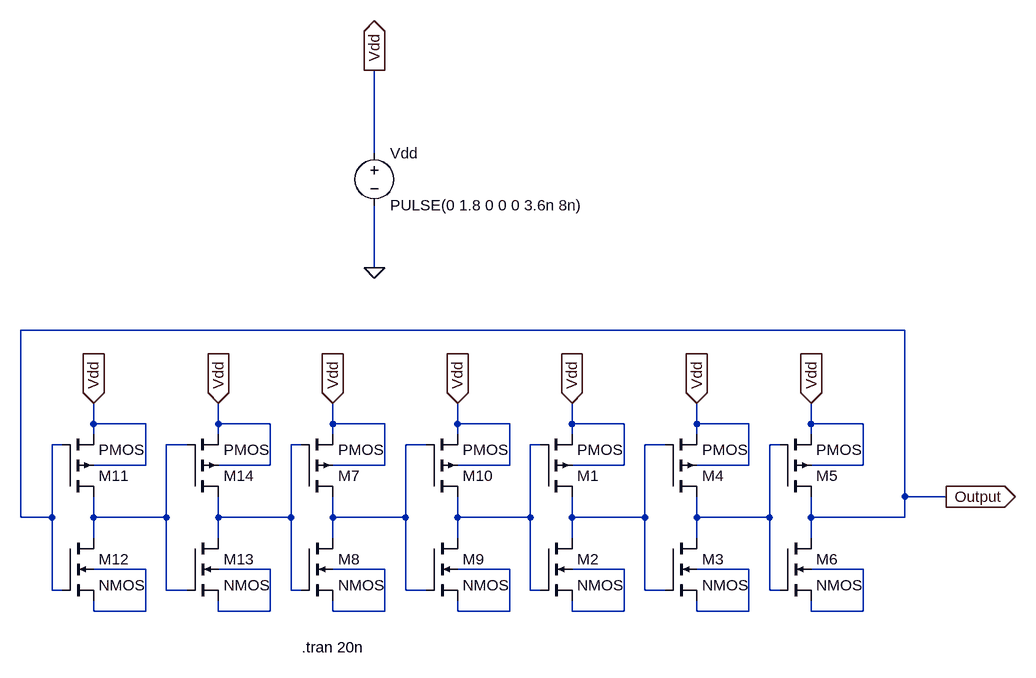
[diagram p0: schematic 7_ring_osc.asc]
7_ring_osc.asc, the LTspice schematic file:
Version 4
SHEET 1 1800 900
WIRE 208 -368 208 -496
WIRE 208 -192 208 -288
WIRE 1024 -96 -336 -96
WIRE -224 48 -224 16
WIRE -144 48 -224 48
WIRE -32 48 -32 16
WIRE 48 48 -32 48
WIRE 144 48 144 16
WIRE 224 48 144 48
WIRE 336 48 336 16
WIRE 416 48 336 48
WIRE 512 48 512 16
WIRE 592 48 512 48
WIRE 704 48 704 16
WIRE 784 48 704 48
WIRE 880 48 880 16
WIRE 960 48 880 48
WIRE -224 64 -224 48
WIRE -32 64 -32 48
WIRE 144 64 144 48
WIRE 336 64 336 48
WIRE 512 64 512 48
WIRE 704 64 704 48
WIRE 880 64 880 48
WIRE -272 80 -288 80
WIRE -80 80 -112 80
WIRE 96 80 80 80
WIRE 288 80 256 80
WIRE 464 80 448 80
WIRE 656 80 624 80
WIRE 832 80 816 80
WIRE -144 112 -144 48
WIRE -144 112 -224 112
WIRE 48 112 48 48
WIRE 48 112 -32 112
WIRE 224 112 224 48
WIRE 224 112 144 112
WIRE 416 112 416 48
WIRE 416 112 336 112
WIRE 592 112 592 48
WIRE 592 112 512 112
WIRE 784 112 784 48
WIRE 784 112 704 112
WIRE 960 112 960 48
WIRE 960 112 880 112
WIRE 1024 160 1024 -96
WIRE 1088 160 1024 160
WIRE -336 192 -336 -96
WIRE -288 192 -288 80
WIRE -288 192 -336 192
WIRE -224 192 -224 160
WIRE -112 192 -112 80
WIRE -112 192 -224 192
WIRE -32 192 -32 160
WIRE 80 192 80 80
WIRE 80 192 -32 192
WIRE 144 192 144 160
WIRE 256 192 256 80
WIRE 256 192 144 192
WIRE 336 192 336 160
WIRE 448 192 448 80
WIRE 448 192 336 192
WIRE 512 192 512 160
WIRE 624 192 624 80
WIRE 624 192 512 192
WIRE 704 192 704 160
WIRE 816 192 816 80
WIRE 816 192 704 192
WIRE 880 192 880 160
WIRE 1024 192 1024 160
WIRE 1024 192 880 192
WIRE -224 224 -224 192
WIRE -32 224 -32 192
WIRE 144 224 144 192
WIRE 336 224 336 192
WIRE 512 224 512 192
WIRE 704 224 704 192
WIRE 880 224 880 192
WIRE -144 272 -224 272
WIRE 48 272 -32 272
WIRE 224 272 144 272
WIRE 416 272 336 272
WIRE 592 272 512 272
WIRE 784 272 704 272
WIRE 960 272 880 272
WIRE -288 304 -288 192
WIRE -272 304 -288 304
WIRE -112 304 -112 192
WIRE -80 304 -112 304
WIRE 80 304 80 192
WIRE 96 304 80 304
WIRE 256 304 256 192
WIRE 288 304 256 304
WIRE 448 304 448 192
WIRE 464 304 448 304
WIRE 624 304 624 192
WIRE 656 304 624 304
WIRE 816 304 816 192
WIRE 832 304 816 304
WIRE -224 336 -224 320
WIRE -144 336 -144 272
WIRE -144 336 -224 336
WIRE -32 336 -32 320
WIRE 48 336 48 272
WIRE 48 336 -32 336
WIRE 144 336 144 320
WIRE 224 336 224 272
WIRE 224 336 144 336
WIRE 336 336 336 320
WIRE 416 336 416 272
WIRE 416 336 336 336
WIRE 512 336 512 320
WIRE 592 336 592 272
WIRE 592 336 512 336
WIRE 704 336 704 320
WIRE 784 336 784 272
WIRE 784 336 704 336
WIRE 880 336 880 320
WIRE 960 336 960 272
WIRE 960 336 880 336
FLAG 512 16 Vdd
IOPIN 512 16 In
FLAG 704 16 Vdd
IOPIN 704 16 In
FLAG 880 16 Vdd
IOPIN 880 16 In
FLAG 1088 160 Output
IOPIN 1088 160 Out
FLAG 208 -192 0
FLAG 208 -496 Vdd
IOPIN 208 -496 Out
FLAG 144 16 Vdd
IOPIN 144 16 In
FLAG 336 16 Vdd
IOPIN 336 16 In
FLAG -224 16 Vdd
IOPIN -224 16 In
FLAG -32 16 Vdd
IOPIN -32 16 In
SYMBOL pmos4 464 160 M180
SYMATTR InstName M1
SYMATTR Value2 l=180n w=720n
SYMBOL nmos4 464 224 R0
SYMATTR InstName M2
SYMATTR Value2 l=180n w=360n
SYMBOL nmos4 656 224 R0
SYMATTR InstName M3
SYMATTR Value2 l=180n w=360n
SYMBOL pmos4 656 160 M180
SYMATTR InstName M4
SYMATTR Value2 l=180n w=720n
SYMBOL pmos4 832 160 M180
SYMATTR InstName M5
SYMATTR Value2 l=180n w=720n
SYMBOL nmos4 832 224 R0
SYMATTR InstName M6
SYMATTR Value2 l=180n w=360n
SYMBOL voltage 208 -384 R0
WINDOW 123 0 0 Left 0
WINDOW 39 0 0 Left 0
SYMATTR InstName Vdd
SYMATTR Value PULSE(0 1.8 0 0 0 3.6n 8n)
SYMBOL pmos4 96 160 M180
SYMATTR InstName M7
SYMATTR Value2 l=180n w=720n
SYMBOL nmos4 96 224 R0
SYMATTR InstName M8
SYMATTR Value2 l=180n w=360n
SYMBOL nmos4 288 224 R0
SYMATTR InstName M9
SYMATTR Value2 l=180n w=360n
SYMBOL pmos4 288 160 M180
SYMATTR InstName M10
SYMATTR Value2 l=180n w=720n
SYMBOL pmos4 -272 160 M180
SYMATTR InstName M11
SYMATTR Value2 l=180n w=720n
SYMBOL nmos4 -272 224 R0
SYMATTR InstName M12
SYMATTR Value2 l=180n w=360n
SYMBOL nmos4 -80 224 R0
SYMATTR InstName M13
SYMATTR Value2 l=180n w=360n
SYMBOL pmos4 -80 160 M180
SYMATTR InstName M14
SYMATTR Value2 l=180n w=720n
TEXT 96 392 Left 2 !.tran 20n

The netlist it stands for:
* 7_ring_osc.asc
M1 N005 N004 Vdd Vdd PMOS l=180n w=720n
M2 N005 N004 N011 N011 NMOS l=180n w=360n
M3 N006 N005 N012 N012 NMOS l=180n w=360n
M4 N006 N005 Vdd Vdd PMOS l=180n w=720n
M5 Output N006 Vdd Vdd PMOS l=180n w=720n
M6 Output N006 N013 N013 NMOS l=180n w=360n
Vdd Vdd 0 PULSE(0 1.8 0 0 0 3.6n 8n)
M7 N003 N002 Vdd Vdd PMOS l=180n w=720n
M8 N003 N002 N009 N009 NMOS l=180n w=360n
M9 N004 N003 N010 N010 NMOS l=180n w=360n
M10 N004 N003 Vdd Vdd PMOS l=180n w=720n
M11 N001 Output Vdd Vdd PMOS l=180n w=720n
M12 N001 Output N007 N007 NMOS l=180n w=360n
M13 N002 N001 N008 N008 NMOS l=180n w=360n
M14 N002 N001 Vdd Vdd PMOS l=180n w=720n
.model NMOS NMOS
.model PMOS PMOS
.lib standard.mos
.tran 20n
.backanno
.end